# EAGLE design SRX-dataport-interceptor-breakout (EAGLE 7.3.0)
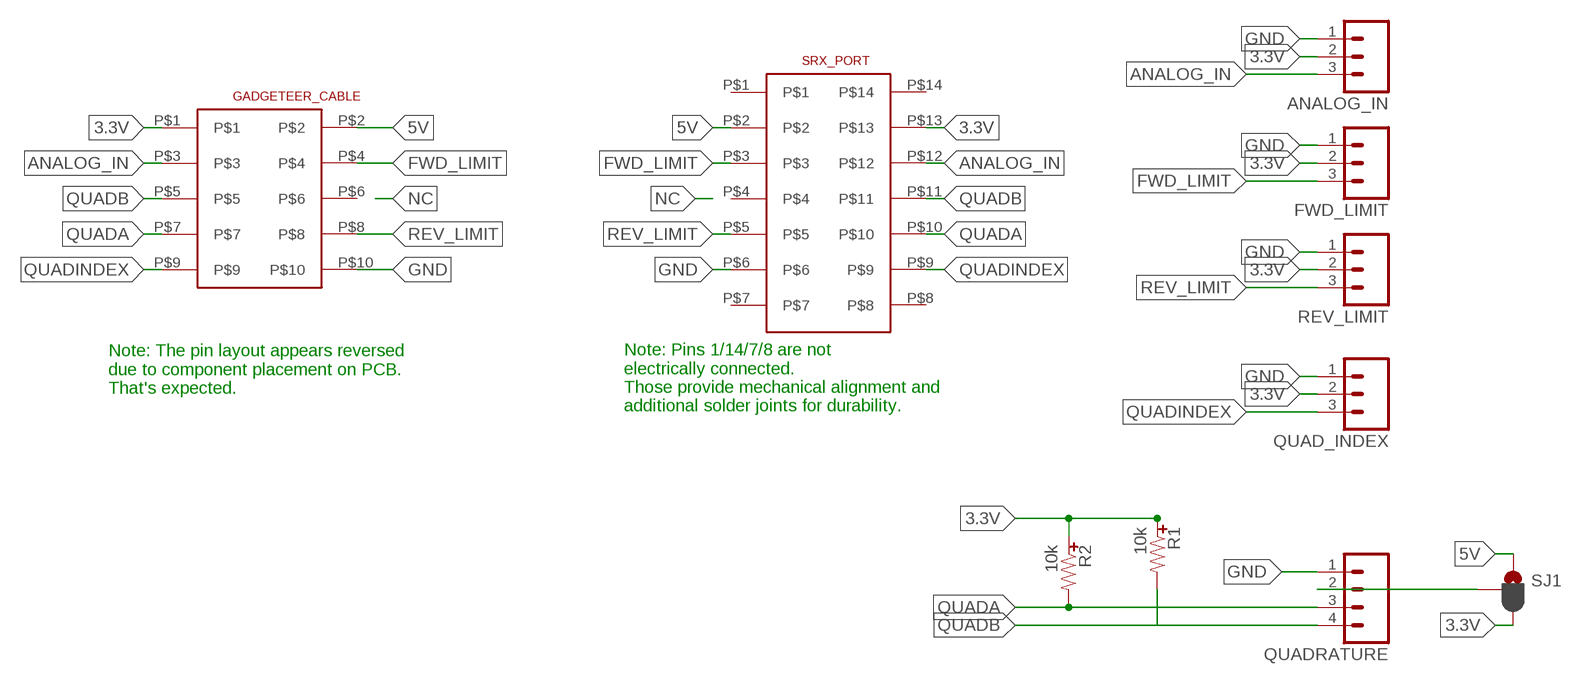
[diagram p0: schematic, sheet 1]

## Parts
ANALOG_IN  M03LOCK  [1X03_LOCK]
FWD_LIMIT  M03LOCK  [1X03_LOCK]
GADGETEER_CABLE  M05X02M_SHROUDED  [M2X05_M_SHROUDED]
QUAD_INDEX  M03LOCK  [1X03_LOCK]
QUADRATURE  M04LOCK  [1X04_LOCK]
R1  10k  RESISTORUNIVERSAL  [0402-0603-0805-UNIVERSAL]
R2  10k  RESISTORUNIVERSAL  [0402-0603-0805-UNIVERSAL]
REV_LIMIT  M03LOCK  [1X03_LOCK]
SJ1  JUMPER-PAD-3-2OF3_NC_BY_PASTE  [PAD-JUMPER-3-2OF3_NC_BY_PASTE_YES_SILK_FULL_BOX]
SRX_PORT  M07X0220021321-00014TFLF  [M2X07_SMD]

## Nets
3.3V: ANALOG_IN.2 FWD_LIMIT.2 GADGETEER_CABLE.P$1 QUAD_INDEX.2 R1.+ R2.+ REV_LIMIT.2 SJ1.3 SRX_PORT.P$13
5V: GADGETEER_CABLE.P$2 SJ1.1 SRX_PORT.P$2
ANALOG_IN: ANALOG_IN.3 GADGETEER_CABLE.P$3 SRX_PORT.P$12
FWD_LIMIT: FWD_LIMIT.3 GADGETEER_CABLE.P$4 SRX_PORT.P$3
GND: ANALOG_IN.1 FWD_LIMIT.1 GADGETEER_CABLE.P$10 QUAD_INDEX.1 QUADRATURE.1 REV_LIMIT.1 SRX_PORT.P$6
QUAD_VOLTAGE: QUADRATURE.2 SJ1.2
QUADA: GADGETEER_CABLE.P$7 QUADRATURE.3 R2.- SRX_PORT.P$10
QUADB: GADGETEER_CABLE.P$5 QUADRATURE.4 R1.- SRX_PORT.P$11
QUADINDEX: GADGETEER_CABLE.P$9 QUAD_INDEX.3 SRX_PORT.P$9
REV_LIMIT: GADGETEER_CABLE.P$8 REV_LIMIT.3 SRX_PORT.P$5
Unconnected: GADGETEER_CABLE.P$6 SRX_PORT.P$1 SRX_PORT.P$4 SRX_PORT.P$7 SRX_PORT.P$8 SRX_PORT.P$14

## Notes on the sheet
- Note: The pin layout appears reversed
  due to component placement on PCB.
  That's expected.
- Note: Pins 1/14/7/8 are not
  electrically connected.
  Those provide mechanical alignment and 
  additional solder joints for durability.

## Library data of the parts
ANALOG_IN FWD_LIMIT QUAD_INDEX REV_LIMIT = SparkFun-Connectors:M03: Header 3 Standard 3-pin 0.1" header. Use with straight break away headers (SKU : PRT-00116), right angle break away headers (PRT-00553), swiss pins (PRT-00743), machine pins (PRT-00117), and female headers (PRT-00115). Molex polarized connector foot print use with SKU : PRT-08232 with associated crimp pins and housings.
GADGETEER_CABLE = tekdemo:M05X02
QUADRATURE = SparkFun-Connectors:M04: Header 4 Standard 4-pin 0.1" header. Use with straight break away headers (SKU : PRT-00116), right angle break away headers (PRT-00553), swiss pins (PRT-00743), machine pins (PRT-00117), and female headers (PRT-00115). Molex polarized connector foot print use with SKU : PRT-08231 with associated crimp pins and housings. 1MM SMD Version SKU: PRT-10208
R1 R2 = tekdemo:RESISTOR: Resistor Basic schematic elements and footprints for 0603, 1206, and PTH resistors.
SJ1 = SparkFun-Passives:JUMPER-PAD-3-2OF3_NC_BY_PASTE
SRX_PORT = tekdemo:M07X02

## Board
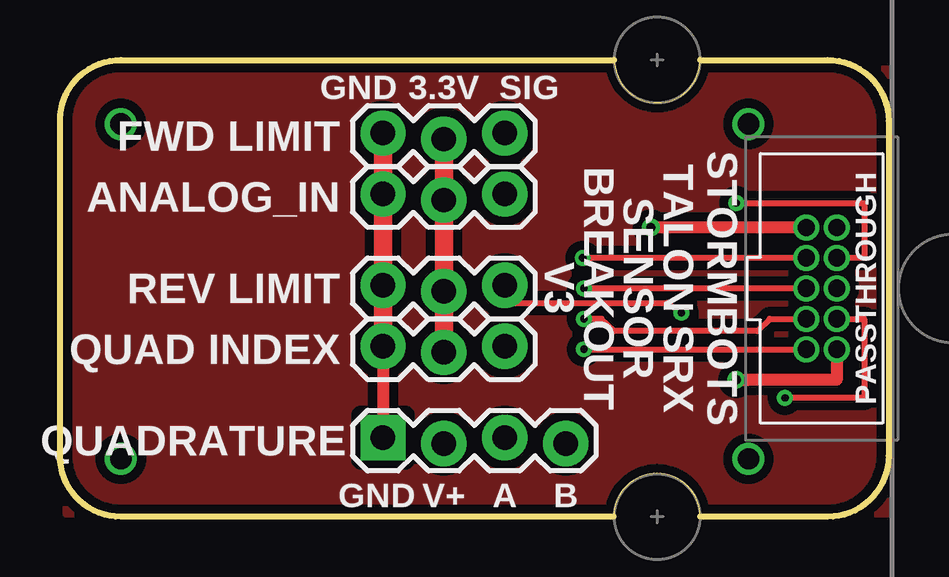
[diagram p1: board, top side]
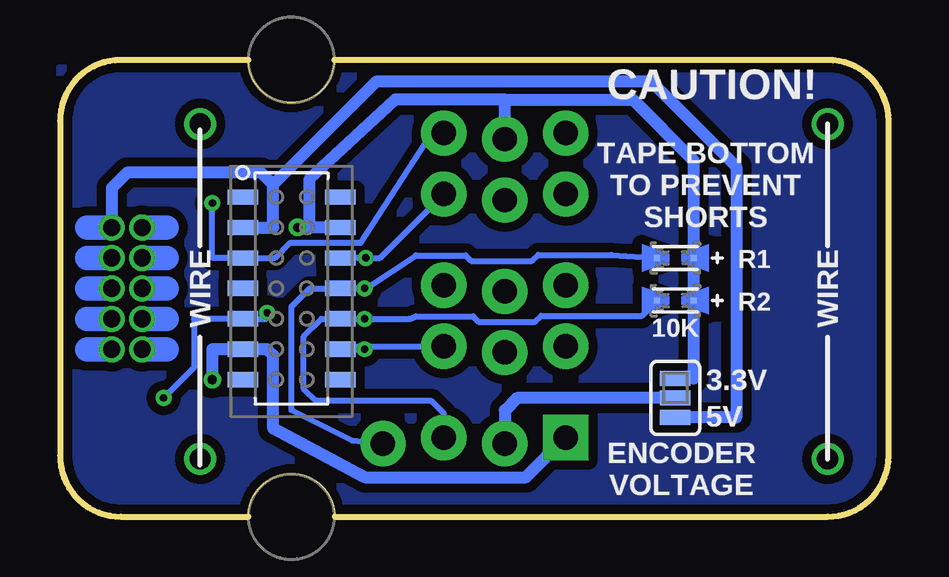
[diagram p2: board, bottom side, seen from below]

Size 34.54 x 19.05 mm. Coordinates in mm from the lower left corner, seen from the top.
Outline: 26.7,19.05 32,19.05 arc-90 34.54,16.51 34.54,2.54 arc-90 32,0 26.7,0 arc180 23.09,0 2.54,0 arc-90 0,2.54 0,16.51 arc-90 2.54,19.05 23.11,19.05 arc180 26.7,19.05
Copper layers (1*16): Top 0.0356mm / dielectric 1.5011mm / Bottom 0.0356mm
Design rules "LaenPCBOrder *": minimum track width 6mil, minimum drill 13mil, track to track 6mil, track to pad 6mil, pad to pad 6mil, via to via 6mil, smd to smd 0mil, copper to edge 15mil, drill to drill 6mil, minimum pad ring 7mil, minimum via ring 7mil, stop-mask expansion 4mil, vias tented up to drill 15mil, thermal gap 10mil
bKeepout: area 7.1,8 to 10.7,11.8; area 7.6,3.2 to 10.2,6.5; area 12.2,1.7 to 20.1,17.4; area 20.1,1.7 to 22.4,4.4; area 30.2,6 to 33.3,13.1; area 22.1,5 to 27.9,14.1; 24 lines

### Footprints (pad centres in the part's own frame; a part is rotated, then mirrored left to right if it is on the bottom)
1X03_LOCK = drill 1.016 pad 1.88: 1 0,0.127; 2 2.54,-0.127; 3 5.08,0.127
M2X05_M_SHROUDED = drill 0.72 pad 1.016: P$1 -2.54,-0.635; P$2 -2.54,0.635; P$3 -1.27,-0.635; P$4 -1.27,0.635; P$5 0,-0.635; P$6 0,0.635; P$7 1.27,-0.635; P$8 1.27,0.635; P$9 2.54,-0.635; P$10 2.54,0.635
1X04_LOCK = drill 1.016 pad 1.88 square: 1 0,0.127 | drill 1.016 pad 1.88: 2 2.54,-0.127; 3 5.08,0.127; 4 7.62,-0.127
0402-0603-0805-UNIVERSAL = smd 0.254 x 0.254: + -0.762,0; - 0.762,0
PAD-JUMPER-3-2OF3_NC_BY_PASTE_YES_SILK_FULL_BOX = smd 0.635 x 1.27: 1 -0.813,0; 2 0,0; 3 0.813,0
M2X07_SMD = smd 0.635 x 1.27: P$1 -3.81,-2.032; P$2 -2.54,-2.032; P$3 -1.27,-2.032; P$4 0,-2.032; P$5 1.27,-2.032; P$6 2.54,-2.032; P$7 3.81,-2.032; P$8 3.81,2.032; P$9 2.54,2.032; P$10 1.27,2.032; P$11 0,2.032; P$12 -1.27,2.032; P$13 -2.54,2.032; P$14 -3.81,2.032

### Placement (x,y rotation side)
ANALOG_IN  13.46,13.34 0 top
FWD_LIMIT  13.46,15.88 0 top
GADGETEER_CABLE  31.75,9.53 270 top
QUAD_INDEX  13.46,6.98 0 top
QUADRATURE  13.46,3.18 0 top
R1  8.89,10.8 180 bottom
R2  8.89,9.02 180 bottom
REV_LIMIT  13.46,9.53 0 top
SJ1  8.89,4.95 90 bottom
SRX_PORT  24.89,9.53 270 bottom
U$1  [TALONSRX]  24.89,9.53 0 top

### Tracks (layer width: path | path; a pad name or v marks a point on that pad's centre or on a via)
3.3V  (via drill 0.38)
  Top 0.508: GADGETEER_CABLE.P$1 v24.64,12.07
  Top 0.762: REV_LIMIT.2 ANALOG_IN.2 QUAD_INDEX.2 FWD_LIMIT.2
  Bottom 0.508: FWD_LIMIT.2 16,17.4 | 16,17.4 20.57,17.4 24.13,14.1 24.13,12.07 | 16,17.4 10.67,17.4 8.13,14.86 R1.+ R2.+ 8.13,5.77 SJ1.3 | SRX_PORT.P$13 24.13,12.07 | v24.64,12.07 24.13,12.07
5V
  Bottom 0.508: SJ1.1 6.35,4.14 6.35,14.61 9.91,18.16 21.34,18.16 25.65,13.84 | SRX_PORT.P$2 25.65,12.07 25.65,13.84 | GADGETEER_CABLE.P$2 32.39,13.72 31.75,14.35 26.16,14.35 25.65,13.84
ANALOG_IN  (via drill 0.3)
  Top 0.254: GADGETEER_CABLE.P$3 v21.79,10.8
  Bottom 0.254: v21.79,10.8 22.84,10.82 SRX_PORT.P$12 v21.79,10.8 | v21.79,10.8 21.21,10.8 ANALOG_IN.3
FWD_LIMIT  (via drill 0.3)
  Top 0.203: 30.48,13.08 30.23,13.08
  Top 0.254: v28.19,13.08 30.48,13.08 33.53,13.08 33.53,10.8 GADGETEER_CABLE.P$4
  Bottom 0.254: FWD_LIMIT.3 19.03,16 22,11.43 24.94,11.43 25.58,10.8 SRX_PORT.P$3 28.19,10.8 v28.19,13.08
GND  (via drill 0.38)
  Top 0.508: QUAD_INDEX.1 QUADRATURE.1 13.46,3.43 | GADGETEER_CABLE.P$10 32.39,5.71 28.7,5.71 v28.19,5.71
  Top 0.762: REV_LIMIT.1 ANALOG_IN.1 QUAD_INDEX.1 FWD_LIMIT.1
  Bottom 0.508: QUADRATURE.1 15.11,1.65 21.84,1.65 25.65,3.68 25.65,6.73 25.91,6.98 SRX_PORT.P$6 28.19,6.98 v28.19,5.71
N$2  (via drill 0.89)
  other vias: 28.7,2.41
N$3  (via drill 0.89)
  other vias: 28.7,16.38
N$4  (via drill 0.89)
  other vias: 2.54,2.41
N$5  (via drill 0.89)
  other vias: 2.54,16.38
N$13
  pour Top (isolate 0.381): 0.25,18.67 0.25,0.13 22.35,0.13 24.89,1.91 26.67,0.13 34.54,0.13 34.54,18.67 26.67,18.67 24.89,17.14 23.11,18.67
NC
  pour Bottom (isolate 0.381): 0.51,0.38 0.25,18.67 23.11,18.67 24.89,17.14 26.67,18.67 34.54,18.67 34.54,0.63 26.16,0.63 24.89,1.91 23.62,0.63
QUAD_VOLTAGE
  Bottom 0.508: SJ1.2 15.49,4.95 16,4.45 QUADRATURE.2
QUADA  (via drill 0.3)
  Top 0.254: v21.84,8.26 22.58,8.26 23.11,7.75 29.08,7.75 29.59,8.26 GADGETEER_CABLE.P$7
  Bottom 0.254: QUADRATURE.3 18.54,4.32 19.05,4.83 23.88,4.83 24.38,5.33 24.38,7.52 23.65,8.26 SRX_PORT.P$10 v21.84,8.26 19.99,8.26 19.71,8.36 17.32,8.36 17.09,8.13 14.73,8.13 14.48,8.38 10.29,8.38 R2.-
QUADB  (via drill 0.3)
  Top 0.254: GADGETEER_CABLE.P$5 v21.84,9.53
  Bottom 0.254: R1.- 11.56,10.92 14.61,10.92 14.86,10.67 17.4,10.67 17.63,10.9 19.71,10.9 21.72,9.55 v21.84,9.53 | v21.84,9.53 22.84,9.55 SRX_PORT.P$11 | QUADRATURE.4 22.35,3.18 24.89,4.45 24.89,8.76 24.13,9.53 SRX_PORT.P$11 | v21.84,9.53 SRX_PORT.P$11
QUADINDEX  (via drill 0.3)
  Top 0.254: v21.84,6.98 GADGETEER_CABLE.P$9
  Bottom 0.254: QUAD_INDEX.3 22.73,7.11 SRX_PORT.P$9 v21.84,6.98
REV_LIMIT  (via drill 0.3)
  Top 0.254: REV_LIMIT.3 18.54,8.92 25.32,8.92 v25.91,8.51 | GADGETEER_CABLE.P$8 33.53,8.26 33.53,4.95 v30.23,4.95
  Bottom 0.254: v25.91,8.51 25.93,8.26 SRX_PORT.P$5 28.96,8.26 28.96,6.22 v30.23,4.95

### Text on the board
tPlace: GND | 3.3V | SIG | FWD LIMIT | ANALOG_IN | REV LIMIT | TALON SRX / SENSOR / BREAKOUT / V3 | STORMBOTS | PASSTHROUGH | QUAD INDEX | QUADRATURE | GND | V+ | A | B
bPlace: CAUTION! | TAPE BOTTOM / TO PREVENT / SHORTS | WIRE | WIRE | 10K | 3.3V | 5V | ENCODER / VOLTAGE